# EasyEDA Pro project ProPrj_Desktop_Pet_Dog_V1.3.epro, schematic Schematic3
Board Name: Board3; Create Date: 2025-08-20; Page Name: P1_1; Project Name: Desktop_Pet_Dog_2.0; Schematic Name: Schematic3; Update Date: 2025-08-20; Company: 嘉立创EDA; Page Size: A4; Version: V1.0
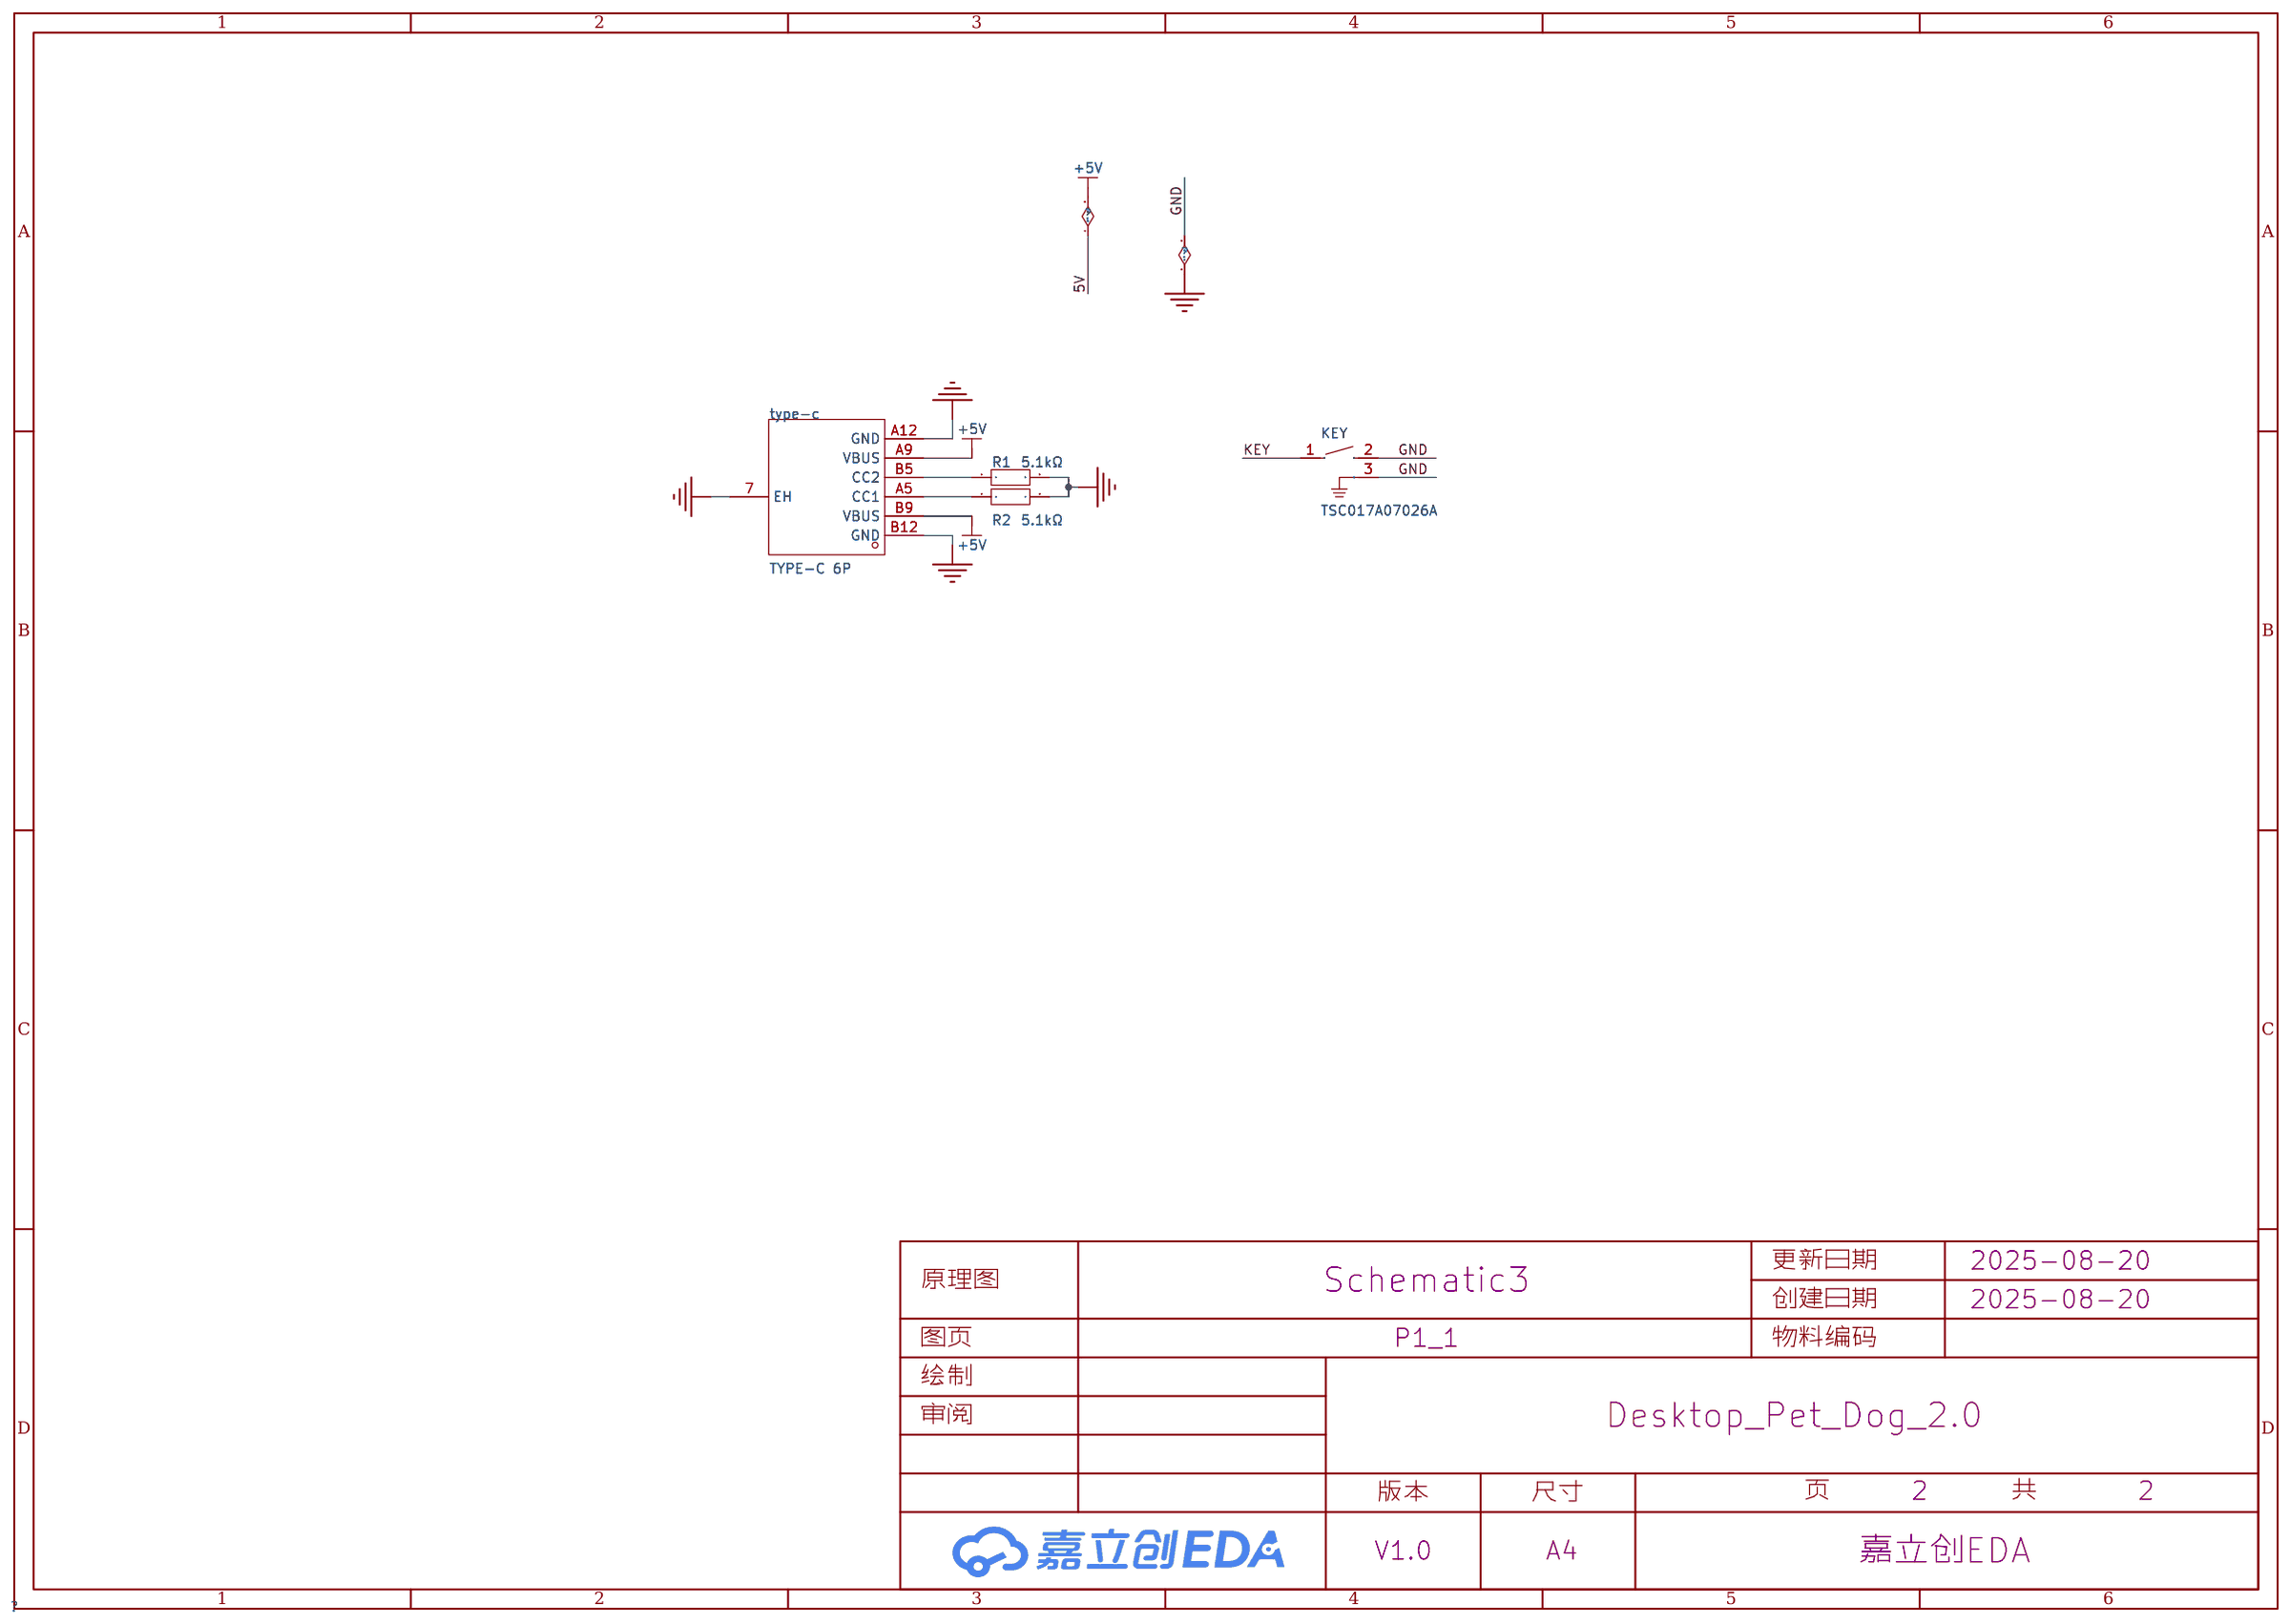
[diagram p2: schematic sheet]

## Parts
KEY  TSC017A07026A  [SW-TH_3P-L4.5-W7.0-P3.00-LS1.9]
R1  5.1kΩ  [R0603]
R2  5.1kΩ  [R0603]
type-c  TYPE-C 6P  [TYPE-C-SMD_TYPE-C-6P]

## Library data of the parts
KEY = TSC017A07026A: 按钮形状:圆形按钮;作用力:2.6N;安装方式:弯插;开关长度:4.5mm;开关宽度:4.5mm;开关高度:7mm;触点电流:50mA;额定电压:12V;工作寿命:-;; LCSC Part Name: 4.5*4.5*7H-J 260gf 边三脚; Supplier Part: C2888533; Manufacturer: BZCN(博众电气); Supplier Footprint: 插件; JLCPCB Part Class: 扩展库; Datasheet: https://atta.szlcsc.com/upload/public/pdf/source/20210826/53484E62D1502C029467A3638274990F.pdf; Supplier: LCSC; Actuator Style: 圆形按钮; Operating Force: 2.6N; Mounting Type: 弯插; Length: 4.5mm; Width: 4.5mm; Switch Height: 7mm; Contact Current: 50mA; Voltage Rating: 12V
R1 R2 = RT0603BRD075K1L: 电阻类型:薄膜电阻;阻值:5.1kΩ;精度:±0.1%;功率:100mW;最大工作电压:75V;温度系数:±25ppm/℃;; LCSC Part Name: 薄膜电阻 5.1kΩ ±0.1% 100mW; Supplier Part: C122969; Manufacturer: YAGEO(国巨); Supplier Footprint: 0603; JLCPCB Part Class: 扩展库; Datasheet: https://atta.szlcsc.com/upload/public/pdf/source/20170728/C122969_1501225761505848820.pdf; Supplier: LCSC; Type: 薄膜电阻; Tolerance: ±0.1%; Power(Watts): 100mW; Overload Voltage (Max): 75V; Temperature Coefficient: ±25ppm/℃; Operating Temperature Range: -55℃~+155℃
type-c = TYPE-C 6P: 连接器类型:Type-C;标准:USB 3.1;公母:母;安装方式:卧贴;触点数量:6P;端口数量:1;额定电流 - 电源:5A;工作温度范围:-40℃~+85℃;; LCSC Part Name: Type-C 母 卧贴; Supplier Part: C456012; Manufacturer: SHOU HAN(首韩); Supplier Footprint: SMD; JLCPCB Part Class: 扩展库; Datasheet: https://atta.szlcsc.com/upload/public/pdf/source/20201203/C456012_B13F72044DF846EDBE9BDD0D1D3CD166.pdf; Supplier: LCSC; Connector Type: Type-C; Standard: USB 3.1; Gender: 母; Mounting Style: 卧贴; Number of Contacts: 6P; Number of Ports: 1; Current Rating - Power (Max): 5A; Operating Temperature Range: -40℃~+85℃; Rated Voltage (Max): 20V; Connect-Disconnect Life: 3千次; Core Colour: 黑色

## Nets
+5V: type-c.A9(VBUS) type-c.B9(VBUS)
GND: KEY.2 KEY.3 R1.2 R2.2 type-c.7(EH) type-c.A12(GND) type-c.B12(GND)
KEY: KEY.1
$3N826: R1.1 type-c.B5(CC2)
$3N830: R2.1 type-c.A5(CC1)
